# Altium schematic sheet MAX232.SchDoc: MAX232 Frsky DJT
size A4; Author: Grzegorz Gajoch; Address1: Grzegorz Gajoch; Revision: 1.0; SheetNumber: 1; SheetTotal: 1
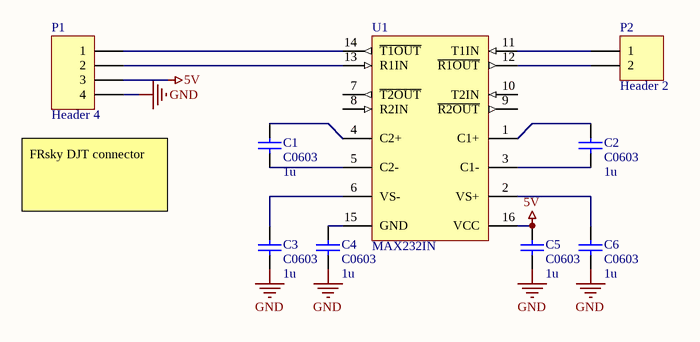
[diagram p0: MAX232.SchDoc]

## Parts
C1  1u  [C0603]
C2  1u  [C0603]
C3  1u  [C0603]
C4  1u  [C0603]
C5  1u  [C0603]
C6  1u  [C0603]
P1  Header 4  [HEADER 1X4 FEMALE]
P2  Header 2  [HEADER 1X2H Male]
U1  MAX232IN  [DIP16]

## Nets
5V: C5.2 P1.3 U1.16(VCC)
GND: C3.1 C4.1 C5.1 C6.1 P1.4
NetC1_1: C1.1 U1.5(C2-)
NetC1_2: C1.2 U1.4(C2+)
NetC2_1: C2.1 U1.3(C1-)
NetC2_2: C2.2 U1.1(C1+)
NetC3_2: C3.2 U1.6(VS-)
NetC4_2: C4.2 U1.15(GND)
NetC6_2: C6.2 U1.2(VS+)
NetP1_1: P1.1 U1.14(~{T1OUT})
NetP1_2: P1.2 U1.13(R1IN)
NetP2_1: P2.1 U1.11(T1IN)
NetP2_2: P2.2 U1.12(~{R1OUT})

Not connected (* = marked no-connect by the designer): U1 7(~{T2OUT}) 8(R2IN) 9(~{R2OUT}) 10(T2IN)

## Notes on the sheet
- (near P1) FRsky DJT connector
- Title
- Size:
- Date:
- A4
- Number:
- Time:
- Revision:
- Sheet
- of
- File:

## Library data of the parts
C1-C6 = Cap: Generic capacitor; Packge: C0603; Value: 1u
P1 = Header 4: Header, 4-Pin; LatestRevisionDate: 17-Jul-2002; LatestRevisionNote: Re-released for DXP Platform.; Publisher: Altium Limited
P2 = Header 2: Header, 2-Pin; LatestRevisionDate: 17-Jul-2002; LatestRevisionNote: Re-released for DXP Platform.; Publisher: Altium Limited
U1 = MAX232IN: Dual EIA-232 Driver / Receiver, -40 to 85 degC, 16-Pin PDIP (N), Pb-Free (RoHS); SubFamily: RS-232; Drivers Per Package: 2; Supply Voltage(s)(V): 5; ESD HBM(kV): +/-2; ICC(Max)(mA): 10; Single Supply: TRUE; DatasheetVersion: SLLS047L; PackageVersion: revE, Dec-2002; PackageReference: N16; PackageDescription: 16-Pin Plastic Dual-In-Line Package, Row Spacing 7.62 mm, Pitch 2.54 mm; Receivers Per Package: 2; RS-232: TRUE; ComponentLink1Description: Manufacturer URL; ComponentLink1URL: www.ti.com; ComponentLink2Description: Datasheet; ComponentLink2URL: http://www.ti.com/general/docs/lit/getliterature.tsp?genericPartNumber=MAX232&fileType=pdf; ComponentLink3Description: Package Specification; ComponentLink3URL: http://www.ti.com/litv/pdf/mpdi002c